# EAGLE schematic concreteJungle_analogInputs (EAGLE 9.2.0)
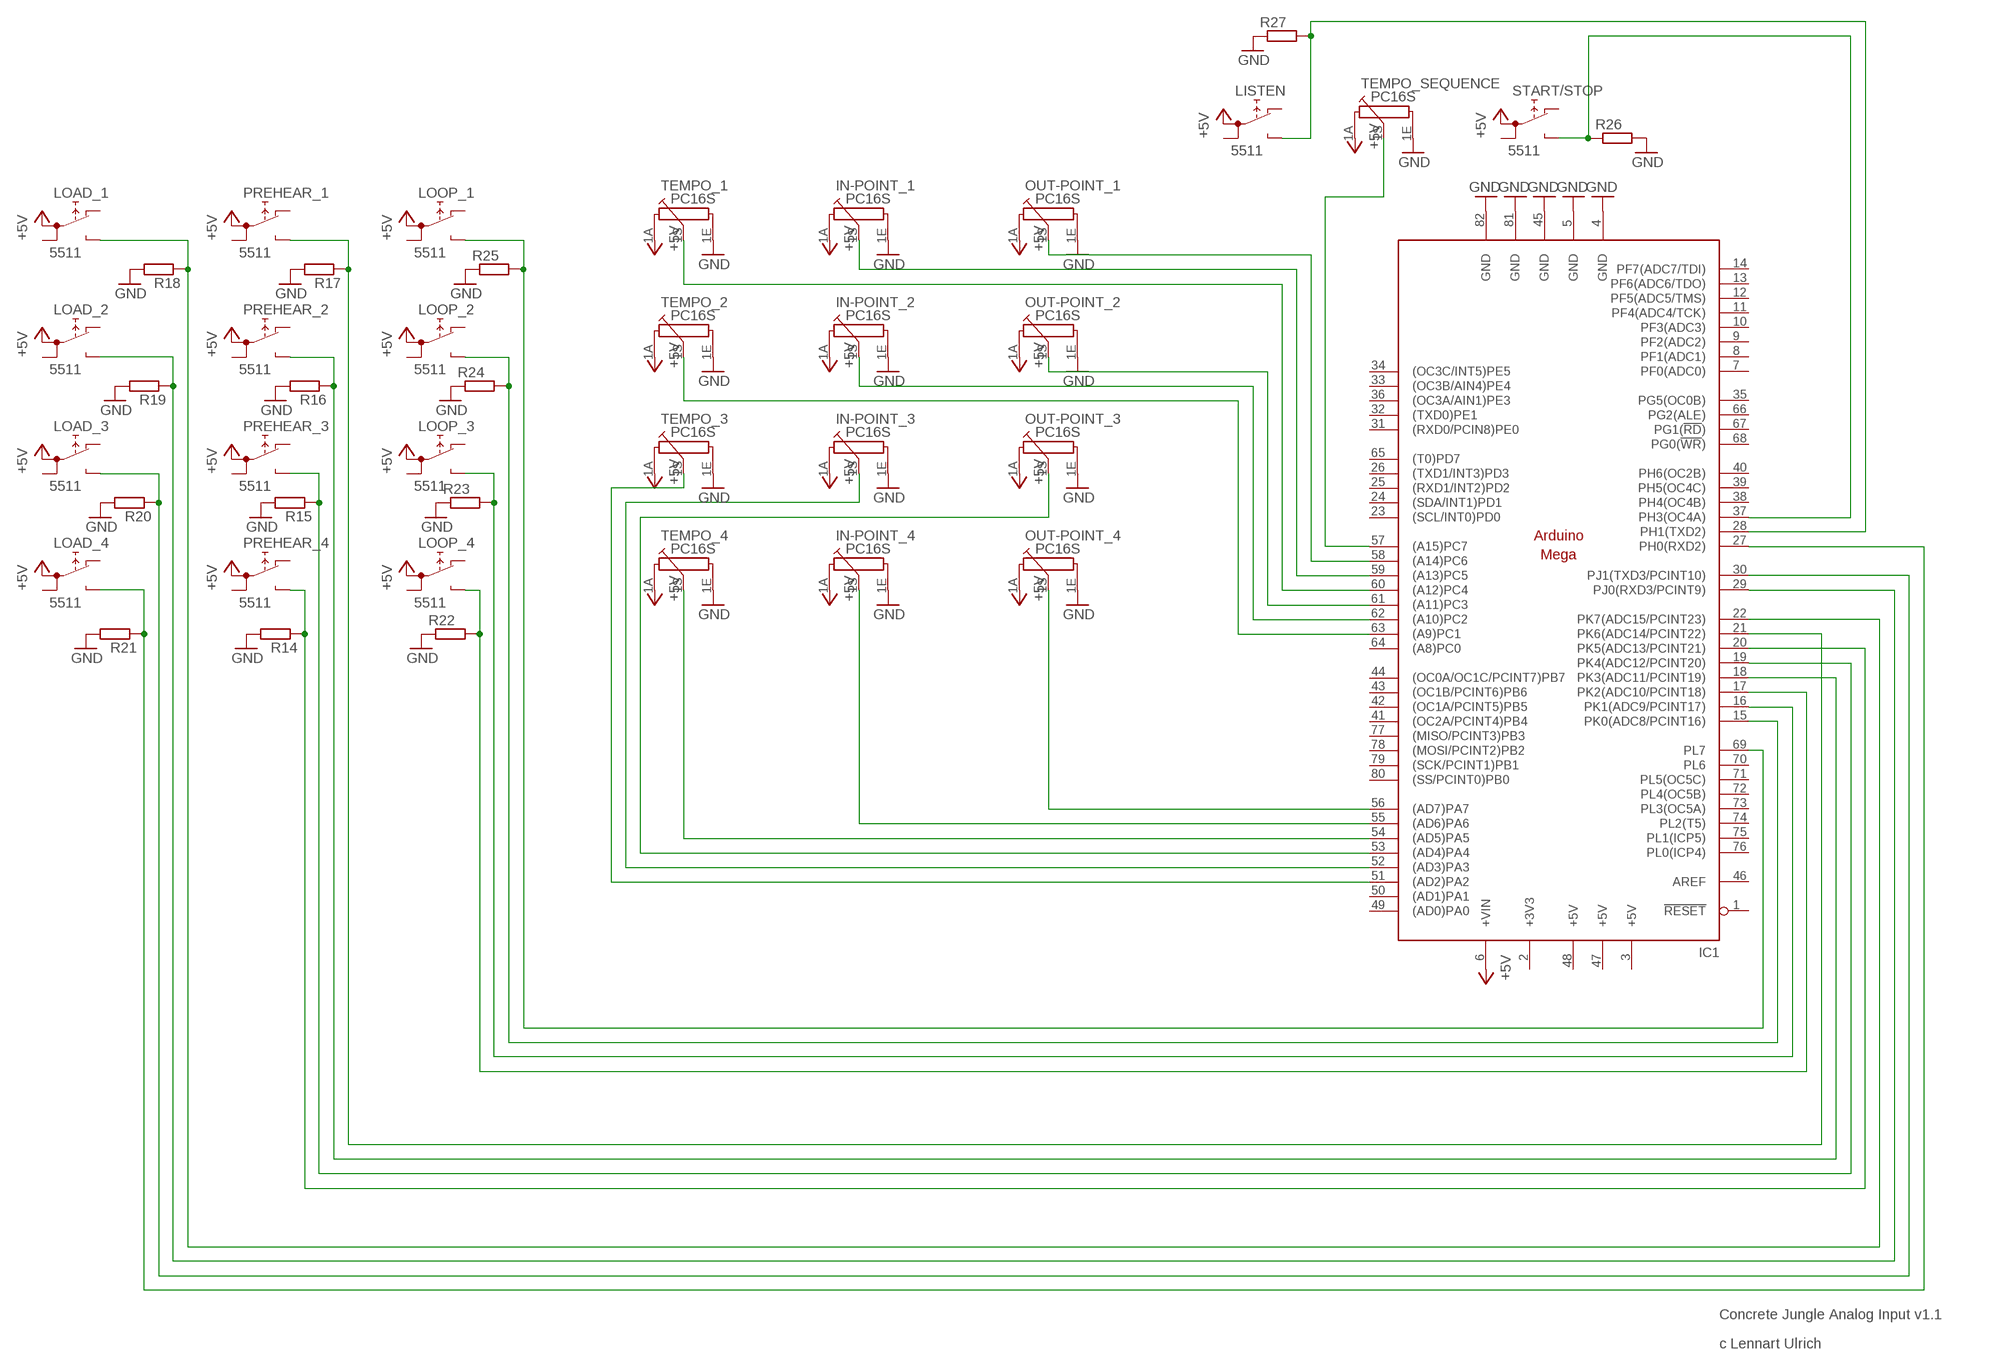
[diagram p0: schematic, sheet 1]

## Parts
IC1  MEGAARDUINO_12  [MEGA_ARDUINO_2]
IN-POINT_1  PC16S  [PC16S]
IN-POINT_2  PC16S  [PC16S]
IN-POINT_3  PC16S  [PC16S]
IN-POINT_4  PC16S  [PC16S]
LISTEN  5511  [5511]
LOAD_1  5511  [5511]
LOAD_2  5511  [5511]
LOAD_3  5511  [5511]
LOAD_4  5511  [5511]
LOOP_1  5511  [5511]
LOOP_2  5511  [5511]
LOOP_3  5511  [5511]
LOOP_4  5511  [5511]
OUT-POINT_1  PC16S  [PC16S]
OUT-POINT_2  PC16S  [PC16S]
OUT-POINT_3  PC16S  [PC16S]
OUT-POINT_4  PC16S  [PC16S]
PREHEAR_1  5511  [5511]
PREHEAR_2  5511  [5511]
PREHEAR_3  5511  [5511]
PREHEAR_4  5511  [5511]
R14  R-EU_0207/12  [0207/12]
R15  R-EU_0207/12  [0207/12]
R16  R-EU_0207/12  [0207/12]
R17  R-EU_0207/12  [0207/12]
R18  R-EU_0207/12  [0207/12]
R19  R-EU_0207/12  [0207/12]
R20  R-EU_0207/12  [0207/12]
R21  R-EU_0207/12  [0207/12]
R22  R-EU_0207/12  [0207/12]
R23  R-EU_0207/12  [0207/12]
R24  R-EU_0207/12  [0207/12]
R25  R-EU_0207/12  [0207/12]
R26  R-EU_0207/12  [0207/12]
R27  R-EU_0207/12  [0207/12]
START/STOP  5511  [5511]
TEMPO_1  PC16S  [PC16S]
TEMPO_2  PC16S  [PC16S]
TEMPO_3  PC16S  [PC16S]
TEMPO_4  PC16S  [PC16S]
TEMPO_SEQUENCE  PC16S  [PC16S]

## Nets
+5V: IC1.6(+VIN) IN-POINT_1.1A IN-POINT_2.1A IN-POINT_3.1A IN-POINT_4.1A LISTEN.1A LOAD_1.1A LOAD_2.1A LOAD_3.1A LOAD_4.1A LOOP_1.1A LOOP_2.1A LOOP_3.1A LOOP_4.1A OUT-POINT_1.1A OUT-POINT_2.1A OUT-POINT_3.1A OUT-POINT_4.1A PREHEAR_1.1A PREHEAR_2.1A PREHEAR_3.1A PREHEAR_4.1A START/STOP.1A TEMPO_1.1A TEMPO_2.1A TEMPO_3.1A TEMPO_4.1A TEMPO_SEQUENCE.1A
GND: IC1.4(GND) IC1.5(GND) IC1.45(GND) IC1.81(GND) IC1.82(GND) IN-POINT_1.1E IN-POINT_2.1E IN-POINT_3.1E IN-POINT_4.1E OUT-POINT_1.1E OUT-POINT_2.1E OUT-POINT_3.1E OUT-POINT_4.1E R14.2 R15.2 R16.2 R17.2 R18.2 R19.2 R20.2 R21.2 R22.1 R23.1 R24.1 R25.1 R26.2 R27.1 TEMPO_1.1E TEMPO_2.1E TEMPO_3.1E TEMPO_4.1E TEMPO_SEQUENCE.1E
N$1: IC1.56((AD7)PA7) OUT-POINT_4.1S
N$2: IC1.55((AD6)PA6) IN-POINT_4.1S
N$3: IC1.54((AD5)PA5) TEMPO_4.1S
N$4: IC1.57((A15)PC7) TEMPO_SEQUENCE.1S
N$5: IC1.58((A14)PC6) OUT-POINT_1.1S
N$6: IC1.59((A13)PC5) IN-POINT_1.1S
N$7: IC1.60((A12)PC4) TEMPO_1.1S
N$8: IC1.61((A11)PC3) OUT-POINT_2.1S
N$9: IC1.62((A10)PC2) IN-POINT_2.1S
N$10: IC1.63((A9)PC1) TEMPO_2.1S
N$11: IC1.53((AD4)PA4) OUT-POINT_3.1S
N$12: IC1.52((AD3)PA3) IN-POINT_3.1S
N$13: IC1.51((AD2)PA2) TEMPO_3.1S
N$14: IC1.17(PK2(ADC10/PCINT18)) LOOP_4.NO R22.2
N$15: IC1.16(PK1(ADC9/PCINT17)) LOOP_3.NO R23.2
N$16: IC1.15(PK0(ADC8/PCINT16)) LOOP_2.NO R24.2
N$17: IC1.20(PK5(ADC13/PCINT21)) PREHEAR_4.NO R14.1
N$18: IC1.19(PK4(ADC12/PCINT20)) PREHEAR_3.NO R15.1
N$19: IC1.69(PL7) LOOP_1.NO R25.2
N$20: IC1.18(PK3(ADC11/PCINT19)) PREHEAR_2.NO R16.1
N$21: IC1.21(PK6(ADC14/PCINT22)) PREHEAR_1.NO R17.1
N$22: IC1.22(PK7(ADC15/PCINT23)) LOAD_1.NO R18.1
N$23: IC1.29(PJ0(RXD3/PCINT9)) LOAD_2.NO R19.1
N$24: IC1.30(PJ1(TXD3/PCINT10)) LOAD_3.NO R20.1
N$25: IC1.27(PH0(RXD2)) LOAD_4.NO R21.1
N$26: IC1.28(PH1(TXD2)) LISTEN.NO R27.2
N$27: IC1.37(PH3(OC4A)) R26.1 START/STOP.NO
Unconnected: IC1.1(!RESET) IC1.7(PF0(ADC0)) IC1.8(PF1(ADC1)) IC1.9(PF2(ADC2)) IC1.10(PF3(ADC3)) IC1.11(PF4(ADC4/TCK)) IC1.12(PF5(ADC5/TMS)) IC1.13(PF6(ADC6/TDO)) IC1.14(PF7(ADC7/TDI)) IC1.23((SCL/INT0)PD0) IC1.24((SDA/INT1)PD1) IC1.25((RXD1/INT2)PD2) IC1.26((TXD1/INT3)PD3) IC1.31((RXD0/PCIN8)PE0) IC1.32((TXD0)PE1) IC1.33((OC3B/AIN4)PE4) IC1.34((OC3C/INT5)PE5) IC1.35(PG5(OC0B)) IC1.36((OC3A/AIN1)PE3) IC1.38(PH4(OC4B)) IC1.39(PH5(OC4C)) IC1.40(PH6(OC2B)) IC1.41((OC2A/PCINT4)PB4) IC1.42((OC1A/PCINT5)PB5) IC1.43((OC1B/PCINT6)PB6) IC1.44((OC0A/OC1C/PCINT7)PB7) IC1.46(AREF) IC1.49((AD0)PA0) IC1.50((AD1)PA1) IC1.64((A8)PC0) IC1.65((T0)PD7) IC1.66(PG2(ALE)) IC1.67(PG1(!RD!)) IC1.68(PG0(!WR!)) IC1.70(PL6) IC1.71(PL5(OC5C)) IC1.72(PL4(OC5B)) IC1.73(PL3(OC5A)) IC1.74(PL2(T5)) IC1.75(PL1(ICP5)) IC1.76(PL0(ICP4)) IC1.77((MISO/PCINT3)PB3) IC1.78((MOSI/PCINT2)PB2) IC1.79((SCK/PCINT1)PB1) IC1.80((SS/PCINT0)PB0) LISTEN.1B LISTEN.NC LOAD_1.1B LOAD_1.NC LOAD_2.1B LOAD_2.NC LOAD_3.1B LOAD_3.NC LOAD_4.1B LOAD_4.NC LOOP_1.1B LOOP_1.NC LOOP_2.1B LOOP_2.NC LOOP_3.1B LOOP_3.NC LOOP_4.1B LOOP_4.NC PREHEAR_1.1B PREHEAR_1.NC PREHEAR_2.1B PREHEAR_2.NC PREHEAR_3.1B PREHEAR_3.NC PREHEAR_4.1B PREHEAR_4.NC START/STOP.1B START/STOP.NC

## Notes on the sheet
- Concrete Jungle Analog Input v1.1
- c Lennart Ulrich

## Power pins joined to a net without a drawn wire
+3V3: IC1.2(+3V3)
+5V: IC1.3(+5V) IC1.47(+5V) IC1.48(+5V)

## Library data of the parts
IC1 = arduino:MEGAARDUINO_1: The Arduino Mega is a microcontroller board based on the ATmega1280. - 54 digital input/output pins (of which 14 can be used as PWM outputs) - 16 analog inputs - 4 UARTs (hardware serial ports) - 16 MHz crystal oscillator - USB connection - power jack - ICSP header - reset button It contains everything needed to support the microcontroller; simply connect it to a computer with a USB cable or power it with a AC-to-DC adapter or battery to get started. The Mega is compatible with most shields designed for the Arduino Duemilanove or Diecimila. http://arduino.cc/en/Main/ArduinoBoardMega
IN-POINT_1-IN-POINT_4 OUT-POINT_1-OUT-POINT_4 TEMPO_1-TEMPO_4 TEMPO_SEQUENCE = piher:PC16S: POTENTIOMETER single carbon potentiometer, 16 mm, S3ROH; OC_FARNELL: 4452940; OC_NEWARK: unknown
LISTEN LOAD_1-LOAD_4 LOOP_1-LOOP_4 PREHEAR_1-PREHEAR_4 START/STOP = switch:55?: PUSHBUTTON SERIES 5500 SWITCHES Source: www.e-switch.com .. 5500.pdf
R14-R27 = rcl:R-EU_: RESISTOR, European symbol; SPICEPREFIX: R